# EAGLE schematic Light_Shield_Test (EAGLE 6.1)
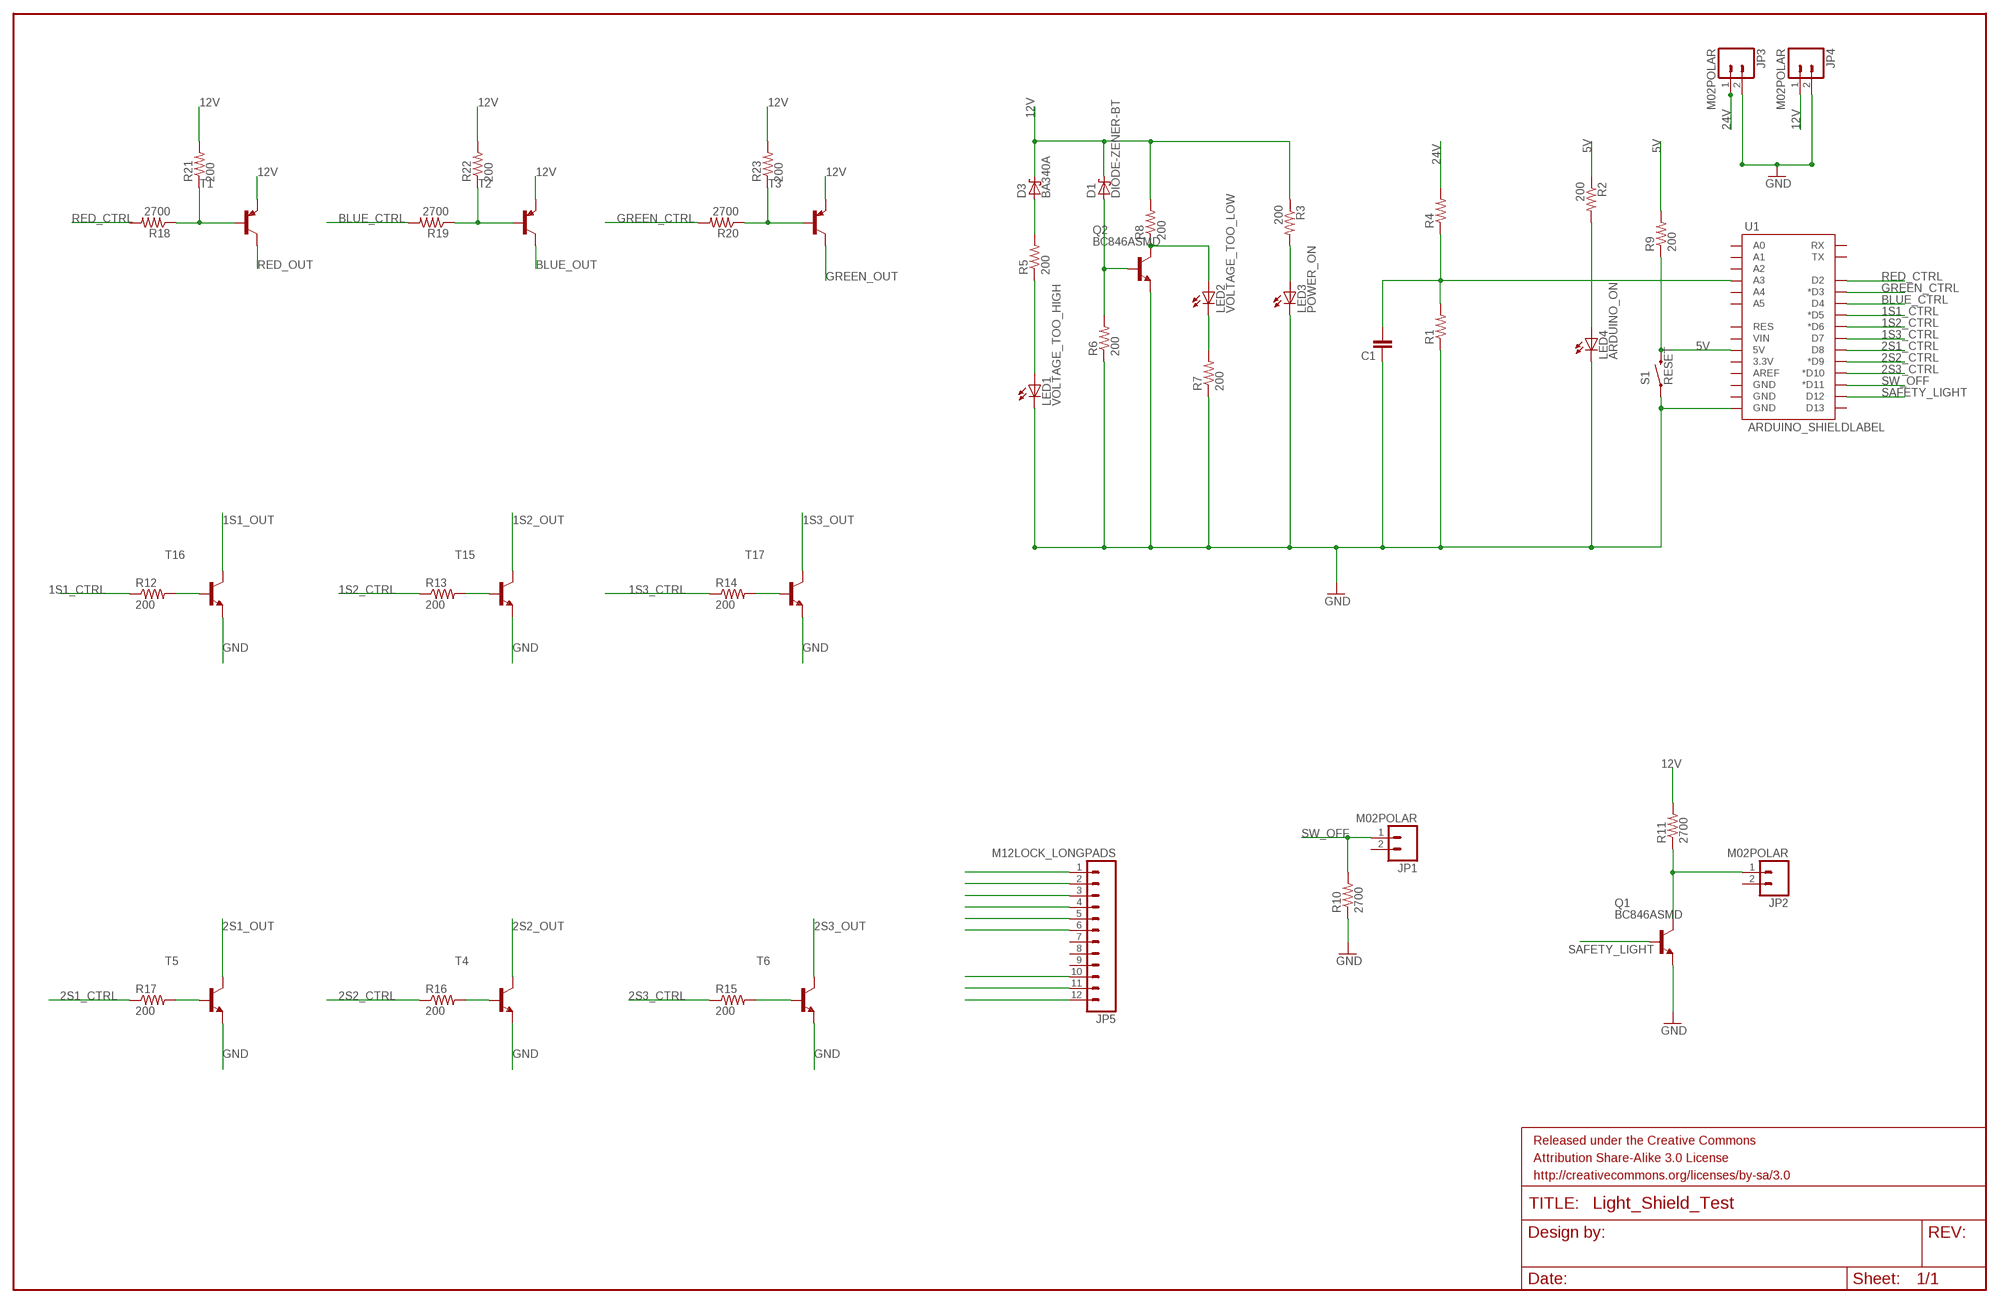
[diagram p0: schematic, sheet 1]

## Parts
C1  CAP0402-CAP  [0402-CAP]
D1  DIODE-ZENER-BT  SMF5.0AT1  [SOD123FL]
D3  BA340A  SMF5.0AT1  [SOD123FL]
FRAME1  FRAME-LEDGER  [CREATIVE_COMMONS]
JP1  M02POLAR  [MOLEX-1X2]
JP2  M02POLAR  [MOLEX-1X2]
JP3  M02POLAR  [MOLEX-1X2]
JP4  M02POLAR  [MOLEX-1X2]
JP5  M12LOCK_LONGPADS  [1X12_LOCK_LONGPADS]
LED1  VOLTAGE_TOO_HIGH  LEDSML0603  [SML0603]
LED2  VOLTAGE_TOO_LOW  LEDSML0603  [SML0603]
LED3  POWER_ON  LEDSML0603  [SML0603]
LED4  ARDUINO_ON  LEDSML0603  [SML0603]
Q1  BC846ASMD  [SOT23]
Q2  BC846ASMD  [SOT23]
R1  RESISTOR0402-RES  [0402-RES]
R2  200  RESISTOR0603  [0603-RES]
R3  200  RESISTOR0603  [0603-RES]
R4  RESISTOR0603  [0603-RES]
R5  200  RESISTOR0603  [0603-RES]
R6  200  RESISTOR0603  [0603-RES]
R7  200  RESISTOR0603-RES  [0603-RES]
R8  200  RESISTOR0603-RES  [0603-RES]
R9  200  RESISTOR0603  [0603-RES]
R10  2700  RESISTOR0603  [0603-RES]
R11  2700  RESISTOR0603  [0603-RES]
R12  200  RESISTOR0603  [0603-RES]
R13  200  RESISTOR0603  [0603-RES]
R14  200  RESISTOR0603  [0603-RES]
R15  200  RESISTOR0603  [0603-RES]
R16  200  RESISTOR0603  [0603-RES]
R17  200  RESISTOR0603  [0603-RES]
R18  2700  RESISTOR0603  [0603-RES]
R19  2700  RESISTOR0603  [0603-RES]
R20  2700  RESISTOR0603  [0603-RES]
R21  200  RESISTOR0603  [0603-RES]
R22  200  RESISTOR0603  [0603-RES]
R23  200  RESISTOR0603  [0603-RES]
S1  RESET  SWITCH-MOMENTARY-2PTH  [TACTILE-PTH]
T1  -PNP-TO220V  [TO220V]
T2  -PNP-TO220V  [TO220V]
T3  -PNP-TO220V  [TO220V]
T4  -NPN-TO220V  [TO220V]
T5  -NPN-TO220V  [TO220V]
T6  -NPN-TO220V  [TO220V]
T15  -NPN-TO220V  [TO220V]
T16  -NPN-TO220V  [TO220V]
T17  -NPN-TO220V  [TO220V]
U1  ARDUINO_SHIELDLABEL  [DUEMILANOVE_SHIELD]

## Nets
1S1_CTRL: R12.1 U1.D5(*D5)
1S1_OUT: JP5.4 T16.2(C)
1S2_CTRL: R13.1 U1.D6(*D6)
1S2_OUT: JP5.5 T15.2(C)
1S3_CTRL: R14.1 U1.D7
1S3_OUT: JP5.6 T17.2(C)
2S1_CTRL: R17.1 U1.D8
2S1_OUT: JP5.10 T5.2(C)
2S2_CTRL: R16.1 U1.D9(*D9)
2S2_OUT: JP5.11 T4.2(C)
2S3_CTRL: R15.1 U1.D10(*D10)
2S3_OUT: JP5.12 T6.2(C)
5V: R2.1 R9.1 R9.2 S1.3 U1.5V
12V: D1.C D3.C JP4.1 R3.1 R8.2 R11.2 R21.2 R22.2 R23.2 T1.3(E) T2.3(E) T3.3(E)
24V: JP3.1 R4.2
BLUE_CTRL: R19.2 U1.D4
BLUE_OUT: JP5.1 T2.2(C)
GND: C1.1 JP3.2 JP4.2 LED1.C LED3.C LED4.C Q1.2(E) Q2.2(E) R1.1 R6.1 R7.1 R10.1 S1.1 T4.3(E) T5.3(E) T6.3(E) T15.3(E) T16.3(E) T17.3(E) U1.GND@0(GND)
GREEN_CTRL: R20.2 U1.D3(*D3)
GREEN_OUT: JP5.2 T3.2(C)
N$1: C1.2 R1.2 R4.1 U1.A3
N$2: LED3.A R3.2
N$3: LED2.A Q2.3(C) R8.1
N$4: D1.A Q2.1(B) R6.2
N$5: LED4.A R2.2
N$6: JP2.1 Q1.3(C) R11.1
N$7: D3.A R5.2
N$8: LED1.A R5.1
N$9: R18.1 R21.1 T1.1(B)
N$10: LED2.C R7.2
N$11: R17.2 T5.1(B)
N$13: R16.2 T4.1(B)
N$14: R15.2 T6.1(B)
N$15: R14.2 T17.1(B)
N$16: R13.2 T15.1(B)
N$17: R12.2 T16.1(B)
N$18: R19.1 R22.1 T2.1(B)
N$19: R20.1 R23.1 T3.1(B)
RED_CTRL: R18.2 U1.D2
RED_OUT: JP5.3 T1.2(C)
SAFETY_LIGHT: Q1.1(B) U1.D12
SW_OFF: JP1.1 R10.2 U1.D11(*D11)
Unconnected: JP1.2 JP2.2 JP5.7 JP5.8 JP5.9 U1.3.3V U1.A0 U1.A1 U1.A2 U1.A4 U1.A5 U1.AREF U1.D13 U1.GND@1(GND) U1.GND@2(GND) U1.RES U1.RX U1.TX U1.VIN

## Library data of the parts
C1 = SparkFun-Capacitors:CAP: Capacitor Standard 0603 ceramic capacitor, and 0.1" leaded capacitor.
D1 D3 = diode:SMF5.0AT1: 200 W Transient Voltage Suppressor Source: Data sheet <http://www.onsemi.com/pub_link/Collateral/SMF5.0AT1-D.PDF>
FRAME1 = SparkFun-Aesthetics:FRAME-LEDGER: Schematic Frame Standard 11x14 US Ledger frame
JP1-JP4 = SparkFun-Connectors:M02: Standard 2-pin 0.1" header. Use with - straight break away headers ( PRT-00116) - right angle break away headers (PRT-00553) - swiss pins (PRT-00743) - machine pins (PRT-00117) - female headers (PRT-00115) Molex polarized connector foot print use with: PRT-08233 with associated crimp pins and housings. 2.54_SCREWTERM for use with PRT-10571. 3.5mm Screw Terminal footprints for PRT-08084 5mm Screw Terminal footprints for use with PRT-08433
JP5 = SparkFun-Connectors:M12: Header 12 Standard 12-pin 0.1" header. Use with straight break away headers (SKU : PRT-00116), right angle break away headers (PRT-00553), swiss pins (PRT-00743), machine pins (PRT-00117), and female headers (PRT-00115).
LED1-LED4 = led:LED: LED OSRAM: - CHIPLED LG R971, LG N971, LY N971, LG Q971, LY Q971, LO R971, LY R971 LH N974, LH R974 LS Q976, LO Q976, LY Q976 LO Q996 - Hyper CHIPLED LW Q18S LB Q993, LB Q99A, LB R99A - SideLED LS A670, LO A670, LY A670, LG A670, LP A670 LB A673, LV A673, LT A673, LW A673 LH A674 LY A675 LS A676, LA A676, LO A676, LY A676, LW A676 LS A679, LY A679, LG A679 - Hyper Micro SIDELED® LS Y876, LA Y876, LO Y876, LY Y876 LT Y87S - SmartLED LW L88C, LW L88S LB L89C, LB L89S, LG L890 LS L89K, LO L89K, LY L89K LS L896, LA L896, LO L896, LY L896 - TOPLED LS T670, LO T670, LY T670, LG T670, LP T670 LSG T670, LSP T670, LSY T670, LOP T670, LYG T670 LG T671, LOG T671, LSG T671 LB T673, LV T673, LT T673, LW T673 LH T674 LS T676, LA T676, LO T676, LY T676, LB T676, LH T676, LSB T676, LW T676 LB T67C, LV T67C, LT T67C, LS T67K, LO T67K, LY T67K, LW E67C LS E67B, LA E67B, LO E67B, LY E67B, LB E67C, LV E67C, LT E67C LW T67C LS T679, LY T679, LG T679 LS T770, LO T770, LY T770, LG T770, LP T770 LB T773, LV T773, LT T773, LW T773 LH T774 LS E675, LA E675, LY E675, LS T675 LS T776, LA T776, LO T776, LY T776, LB T776 LHGB T686 LT T68C, LB T68C - Hyper Mini TOPLED® LB M676 - Mini TOPLED Santana® LG M470 LS M47K, LO M47K, LY M47K Source: http://www.osram.convergy.de LUXEON: - LUMILED® LXK2-PW12-R00, LXK2-PW12-S00, LXK2-PW14-U00, LXK2-PW14-V00 LXK2-PM12-R00, LXK2-PM12-S00, LXK2-PM14-U00 LXK2-PE12-Q00, LXK2-PE12-R00, LXK2-PE12-S00, LXK2-PE14-T00, LXK2-PE14-U00 LXK2-PB12-K00, LXK2-PB12-L00, LXK2-PB12-M00, LXK2-PB14-N00, LXK2-PB14-P00, LXK2-PB14-Q00 LXK2-PR12-L00, LXK2-PR12-M00, LXK2-PR14-Q00, LXK2-PR14-R00 LXK2-PD12-Q00, LXK2-PD12-R00, LXK2-PD12-S00 LXK2-PH12-R00, LXK2-PH12-S00 LXK2-PL12-P00, LXK2-PL12-Q00, LXK2-PL12-R00 Source: www.luxeon.com KINGBRIGHT: KA-3528ASYC Source: www.kingbright.com
Q1 Q2 = transistor-npn:BC846*: NPN Transistor
R1 = SparkFun-Passives:RESISTOR: Resistor Basic schematic elements and footprints for 0603, 1206, and PTH resistors.
R2-R23 = SparkFun-Resistors:RESISTOR: Resistor Basic schematic elements and footprints for 0603, 1206, and PTH resistors.
S1 = SparkFun-Electromechanical:SWITCH-MOMENTARY-2: Various NO switches- pushbuttons, reed, etc
T1-T3 = transistor:*-PNP-: PNP Transistror
T4-T6 T15-T17 = transistor:*-NPN-: NPN Transistror BF959 corrected 2008.03.06
U1 = SparkFun-Boards:ARDUINO_SHIELD: Arduino shield footprint